# EasyEDA Pro project LEDclock_DCF77-RTC-BAT_2026-05-16.epro

# Schematic Schematic1
Board Name: Board1; Create Date: 2026-04-27; Page Name: P1; Project Name: LEDclock_DCF77-RTC-BAT; Schematic Name: Schematic1; Update Date: 2026-05-14; Company: EasyEDA.com; Page Size: A4; Version: V1.0
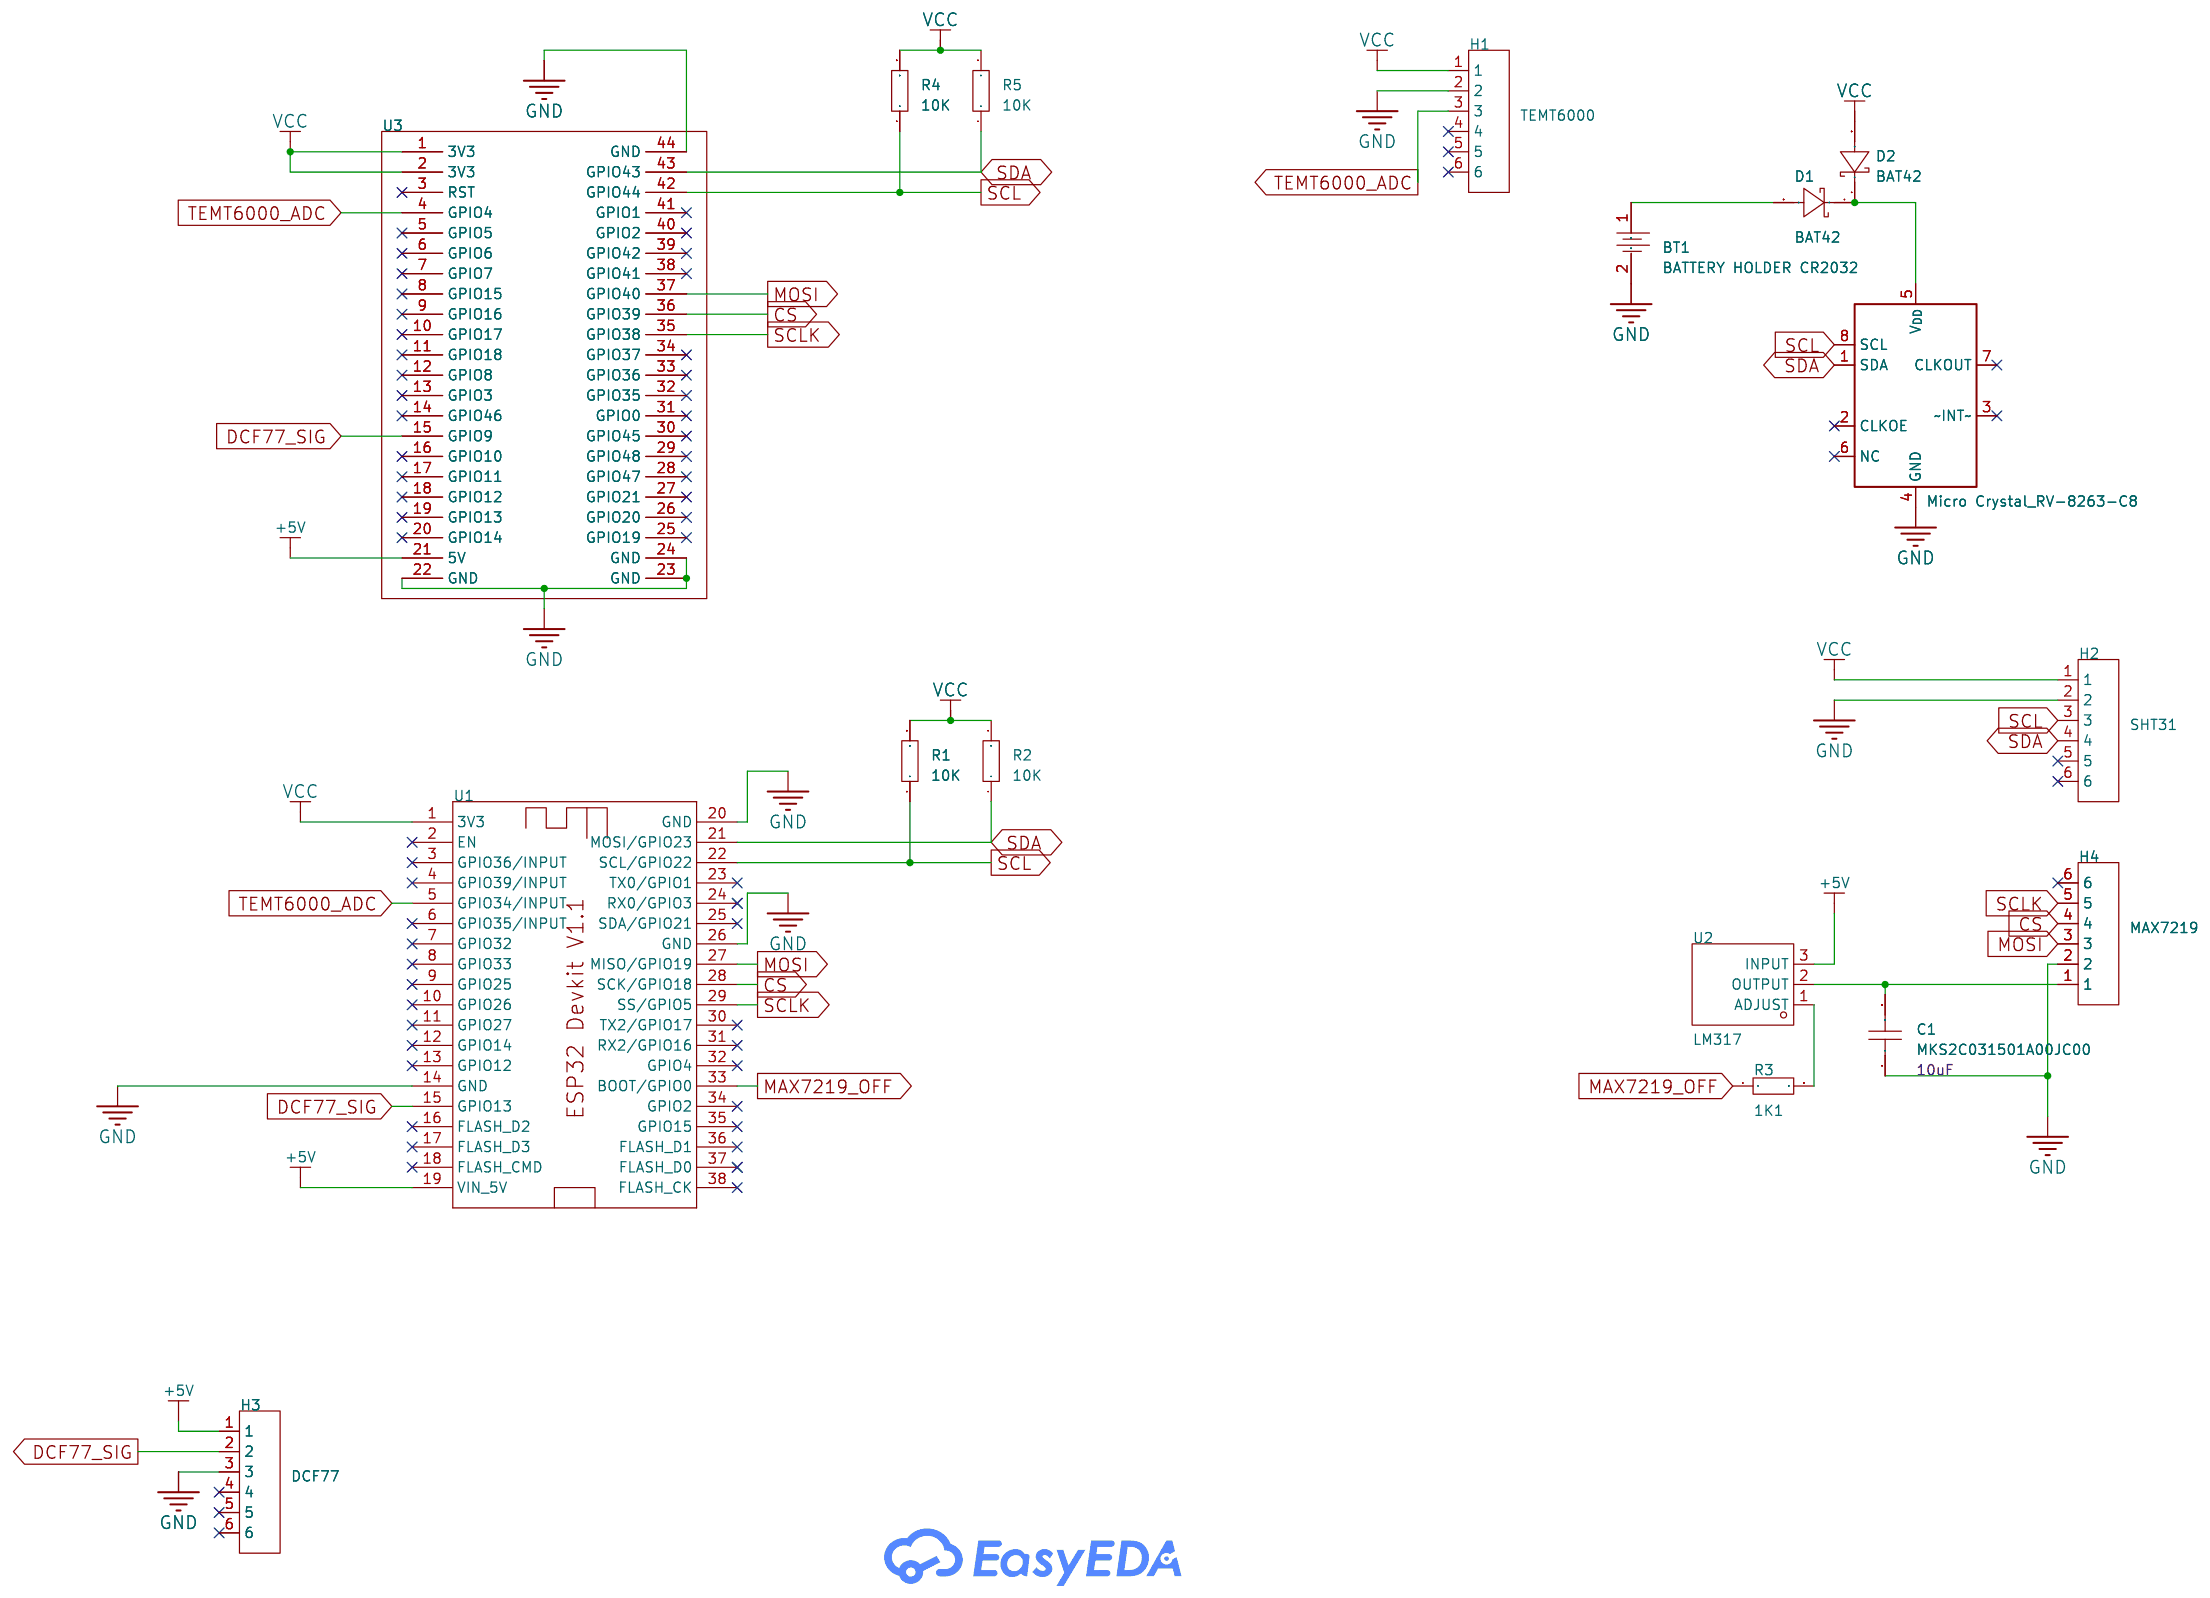
[diagram p0: schematic sheet]

## Parts
BT1  BATTERY HOLDER CR2032  [BAT-TH_FBA25014-S02B2004K]
C1  MKS2C031501A00JC00  [CAP-TH_L7.2-W2.5-P5.00-D0.5-1]
D1  BAT42  [DO-35_BD1.8-L4.1-P7.00-D0.5-RD]
D2  BAT42  [DO-35_BD1.8-L4.1-P7.00-D0.5-RD]
H1  TEMT6000  [CONN-TH_SSQ-106-03-G-S]
H2  SHT31  [CONN-TH_SSQ-106-03-G-S]
H3  DCF77  [CONN-TH_SSQ-106-03-G-S]
H4  MAX7219  [CONN-TH_SSQ-106-03-G-S]
IC2  RV-8263-C8  [Micro Crystal:RV-8263-C8]
R1  10K  [HDR-TH_2P-P5.08_12251103CNSNU000001]
R2  10K  [HDR-TH_2P-P5.08_12251103CNSNU000001]
R3  1K1  [HDR-TH_2P-P5.08_12251103CNSNU000001]
R4  10K  [HDR-TH_2P-P5.08_12251103CNSNU000001]
R5  10K  [HDR-TH_2P-P5.08_12251103CNSNU000001]
U1  -  [ESP32-DEVKIT-V1.0-38PIN-PCB1.1]
U2  LM317  [TO-220-3_L9.9-W4.5-P2.54-L-1]
U3  -  [ESP32-S3 ESP32-S3-DevKitC-1 N16R8]

## Library data of the parts
BT1 = FBA25014-S02B2004K: Connector Type:Battery Holder Battery Type:- Operating Temperature:-40℃~+85℃ Operating Temperature:-40℃~+85℃; Supplier Part: C2833828; Manufacturer: TXGA(特思嘉); Supplier Footprint: 插件; JLCPCB Part Class: Extended Part; Datasheet: https://item.szlcsc.com/datasheet/FBA25014-S02B2004K/2995292.html; Supplier: LCSC; Connector Type: Battery Holder; Operating Temperature: -40℃~+85℃
C1 = MKS2C031501A00JC00: Supplier Part: C7420631; Manufacturer: WIMA; Supplier Footprint: CAP-TH; JLCPCB Part Class: Extended Part; Datasheet: https://item.szlcsc.com/datasheet/MKS2C031501A00JC00/8399199.html; Supplier: LCSC; Capacitance: 10uF
D1 D2 = BAT42: Diode Configuration:Independent Voltage - Forward(Vf@If):650mV@50mA Voltage - DC Reverse(Vr):30V Current - Rectified:200mA Reverse Leakage Current (Ir):500nA@25V Operating Junction Temperature Range:-65℃~+125℃ Operating Junction Temperature Range:-65℃~+12; LCSC Part Name: 电压:30V 电流:200mA; Supplier Part: C2798198; Manufacturer: ST(意法半导体); Supplier Footprint: DO-35; JLCPCB Part Class: Extended Part; Datasheet: https://item.szlcsc.com/datasheet/BAT42/2937121.html; Supplier: LCSC; Diode Configuration: Independent; Voltage - Forward(Vf@If): 650mV@50mA; Voltage - DC Reverse(Vr): 30V; Current - Rectified: 200mA; Reverse Leakage Current (Ir): 500nA@25V; Operating Junction Temperature Range: -65℃~+125℃; Non-Repetitive Peak Forward Surge Current: 4A
H1-H4 = SSQ-106-03-G-S: Holes Structure:1x6P Pitch:2.54mm Row Spacing:- Circular Hole / Square Hole:Square Hole Mounting Type:Through Hole Number of Rows:1 Number of Positions:6P Current Rating:4.7A Voltage Rating (Max):655V Holes Direction:Top Insulation Height:8.51mm Contact M; LCSC Part Name: 1x6P 间距:2.54mm 直插; Supplier Part: C3323798; Manufacturer: SAMTEC; Supplier Footprint: 插件,P=2.54mm; JLCPCB Part Class: Extended Part; Datasheet: https://item.szlcsc.com/datasheet/SSQ-106-03-G-S/3888394.html; Supplier: LCSC; Holes Structure: 1x6P; Pitch: 2.54mm; Circular Hole / Square Hole: Square Hole; Mounting Type: Through Hole; Number of Rows: 1; Number of Positions: 6P; Current Rating: 4.7A; Voltage Rating (Max): 655V; Holes Direction: Top; Insulation Height: 8.51mm; Contact Material: Phosphor bronze; Contact Plating: Gold; Operating Temperature: -55℃~+125℃; PIN Length: 10mm
IC2 = Micro Crystal_RV-8263-C8: Attribute1: IC507; Datasheet: https://www.microcrystal.com/fileadmin/Media/Products/RTC/Datasheet/RV-8263-C8.pdf; manf: Micro Crystal; manf#: RV-8263-C8 32.768kHz-20PPM-TA-QA; mouser#: 428-204291-MC01; User doc link: https://www.microcrystal.com/fileadmin/Media/Products/RTC/Datasheet/RV-8263-C8.pdf
R1-R5 = Res_0603: Supplier Footprint: 0603
U1 = ESP32-DEVKIT-V1.1
U2 = LM317_C7463411: Output Type:Adjustable Voltage - Supply:40V Output Voltage:1.2V~37V Output Voltage:1.2V~37V Output Current:1.5A Power Supply Rejection Ratio (PSRR):75dB@(120Hz) standby current:46uA Features:Short Circuit Protection；Over Current Protection；Over Temperatur; LCSC Part Name: 1.2V~37V 1.5A 40V; Supplier Part: C7463411; Manufacturer: IDCHIP(英锐芯); Supplier Footprint: TO-220; JLCPCB Part Class: Extended Part; Datasheet: https://item.szlcsc.com/datasheet/LM317/8498176.html; Supplier: LCSC; Output Type: Adjustable; Voltage - Supply: 40V; Output Voltage: 1.2V~37V; Output Current: 1.5A; Power Supply Rejection Ratio (PSRR): 75dB@(120Hz); standby current: 46uA; Features: Short Circuit Protection；Over Current Protection；Over Temperature Protection; Operating Temperature: 0℃~+125℃; Output Configuration: Positive; Number of Outputs: 1
U3 = ESP32-S3 ESP32-S3-DevKitC-1 N16R8

## Nets
+5V: H3.1 U1.19(VIN_5V) U2.3(INPUT) U3.21(5V)
GND: BT1.2 C1.1 H1.2 H2.2 H3.3 H4.2 IC2.4(GND) U1.14(GND) U1.20(GND) U1.26(GND) U3.22(GND) U3.23(GND) U3.24(GND) U3.44(GND)
VCC: D2.2(A) H1.1 H2.1 R1.2 R2.2 R4.2 R5.2 U1.1(3V3) U3.1(3V3) U3.2(3V3)
CS: H4.4 U1.28(SCK/GPIO18) U3.36(GPIO39)
DCF77_SIG: H3.2 U1.15(GPIO13) U3.15(GPIO9)
MAX7219_OFF: R3.1 U1.33(BOOT/GPIO0)
MOSI: H4.3 U1.27(MISO/GPIO19) U3.37(GPIO40)
SCL: H2.3 IC2.8(SCL) R1.1 R4.1 U1.22(SCL/GPIO22) U3.42(GPIO44)
SCLK: H4.5 U1.29(SS/GPIO5) U3.35(GPIO38)
SDA: H2.4 IC2.1(SDA) R2.1 R5.1 U1.21(MOSI/GPIO23) U3.43(GPIO43)
TEMT6000_ADC: H1.3 U1.5(GPIO34/INPUT) U3.4(GPIO4)
$1N1771: BT1.1 D1.2(A)
$1N2344: C1.2 H4.1 U2.2(OUTPUT)
$1N3344: D1.1(K) D2.1(K) IC2.5(V_{DD})
$1N4735: R3.2 U2.1(ADJUST)

Not connected (* = marked no-connect by the designer): H1 4* 5* 6*; H2 5* 6*; H3 4* 5* 6*; H4 6*; IC2 2(CLKOE)* 3(~INT~)* 6(NC)* 7(CLKOUT)*; U1 2(EN)* 3(GPIO36/INPUT)* 4(GPIO39/INPUT)* 6(GPIO35/INPUT)* 7(GPIO32)* 8(GPIO33)* 9(GPIO25)* 10(GPIO26)* 11(GPIO27)* 12(GPIO14)* 13(GPIO12)* 16(FLASH_D2)* 17(FLASH_D3)* 18(FLASH_CMD)* 23(TX0/GPIO1)* 24(RX0/GPIO3)* 25(SDA/GPIO21)* 30(TX2/GPIO17)* 31(RX2/GPIO16)* 32(GPIO4)* 34(GPIO2)* 35(GPIO15)* 36(FLASH_D1)* 37(FLASH_D0)* 38(FLASH_CK)*; U3 3(RST)* 5(GPIO5)* 6(GPIO6)* 7(GPIO7)* 8(GPIO15)* 9(GPIO16)* 10(GPIO17)* 11(GPIO18)* 12(GPIO8)* 13(GPIO3)* 14(GPIO46)* 16(GPIO10)* 17(GPIO11)* 18(GPIO12)* 19(GPIO13)* 20(GPIO14)* 25(GPIO19)* 26(GPIO20)* 27(GPIO21)* 28(GPIO47)* 29(GPIO48)* 30(GPIO45)* 31(GPIO0)* 32(GPIO35)* 33(GPIO36)* 34(GPIO37)* 38(GPIO41)* 39(GPIO42)* 40(GPIO2)* 41(GPIO1)*

# Board PCB1 - Europlatine
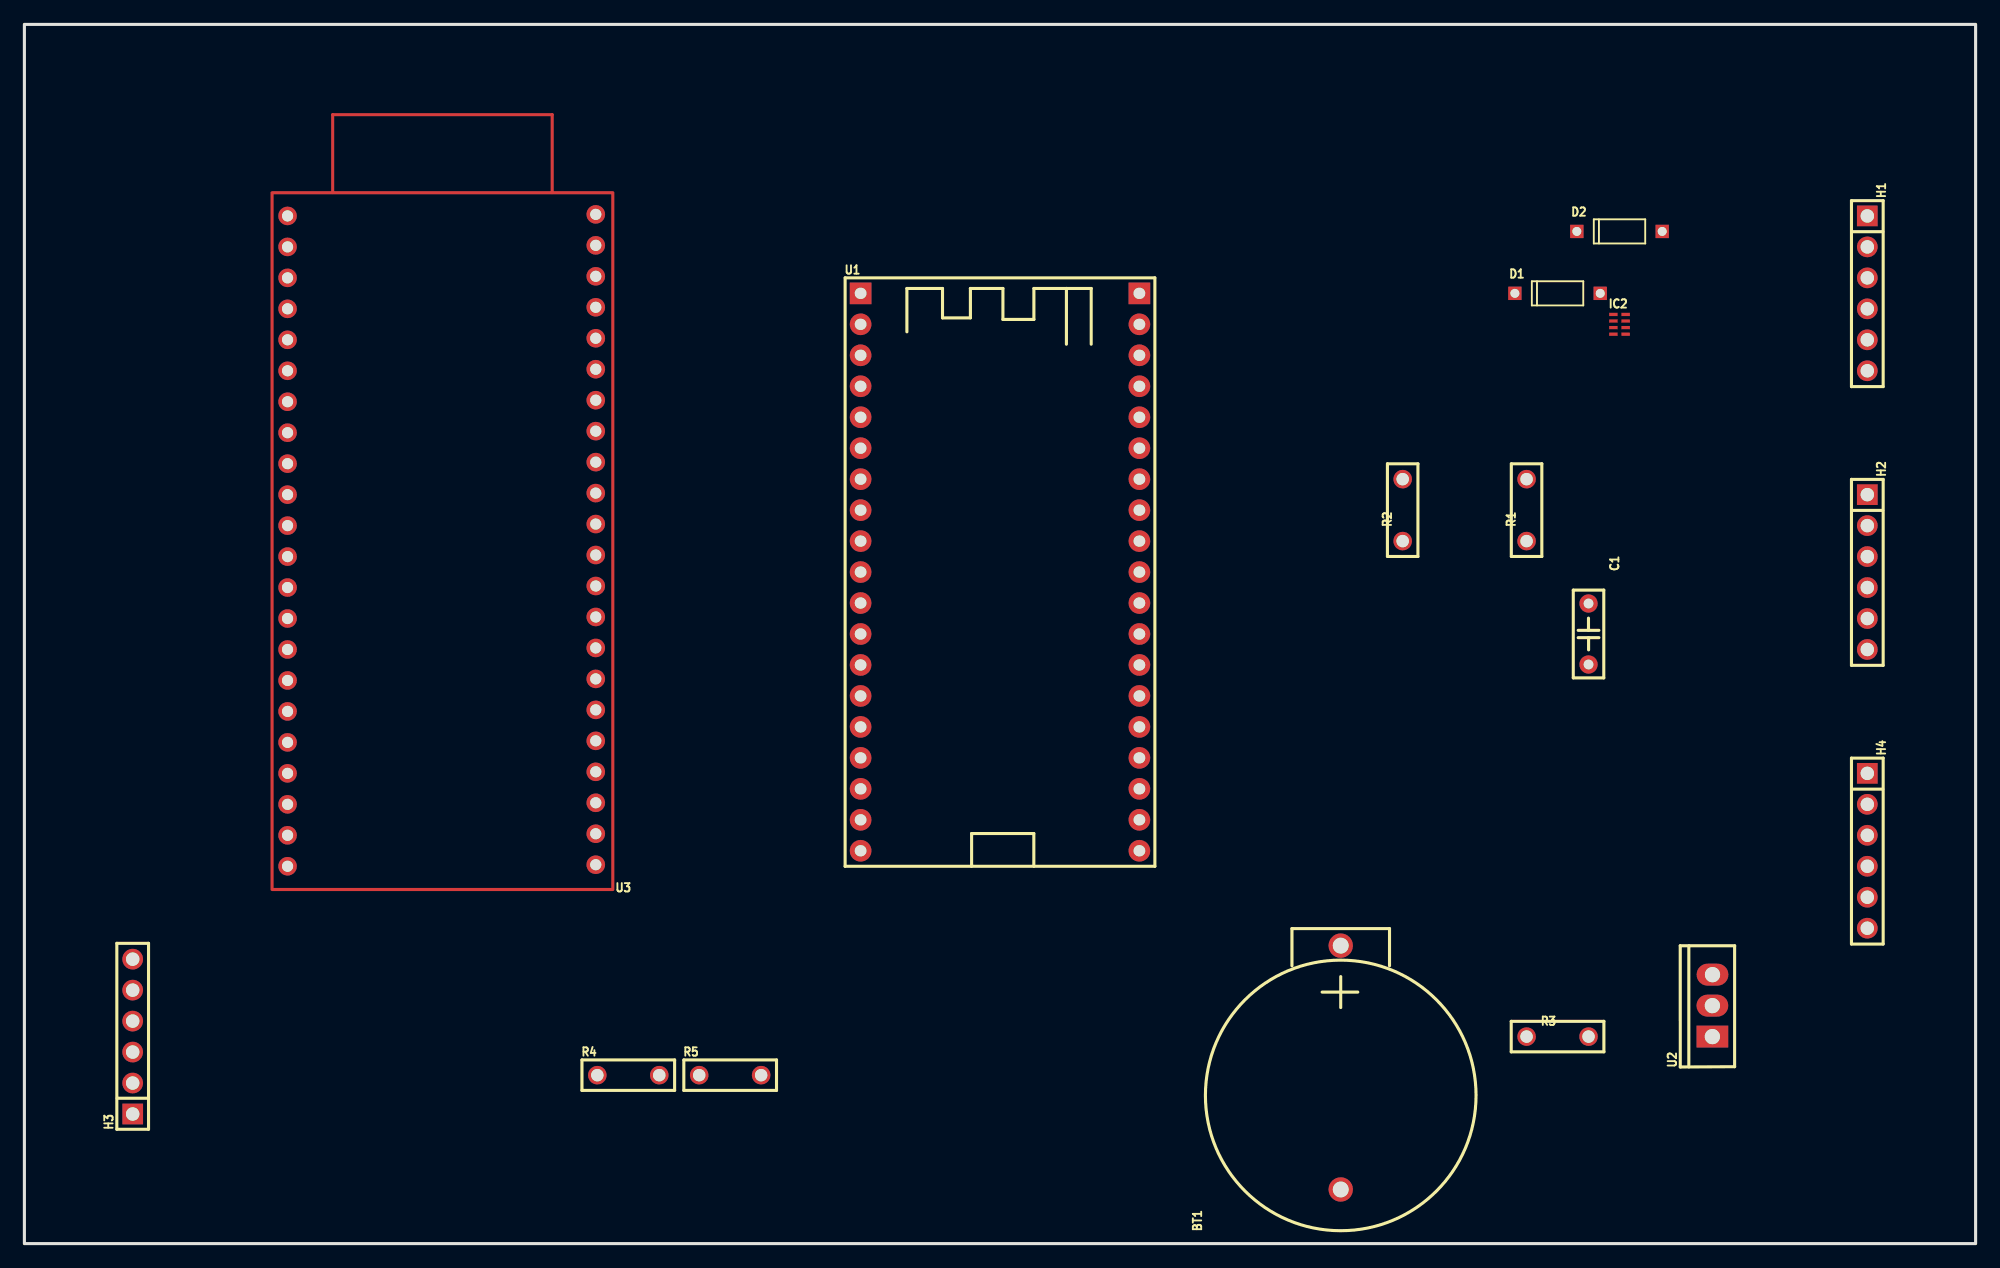
[diagram p1: board, top side]
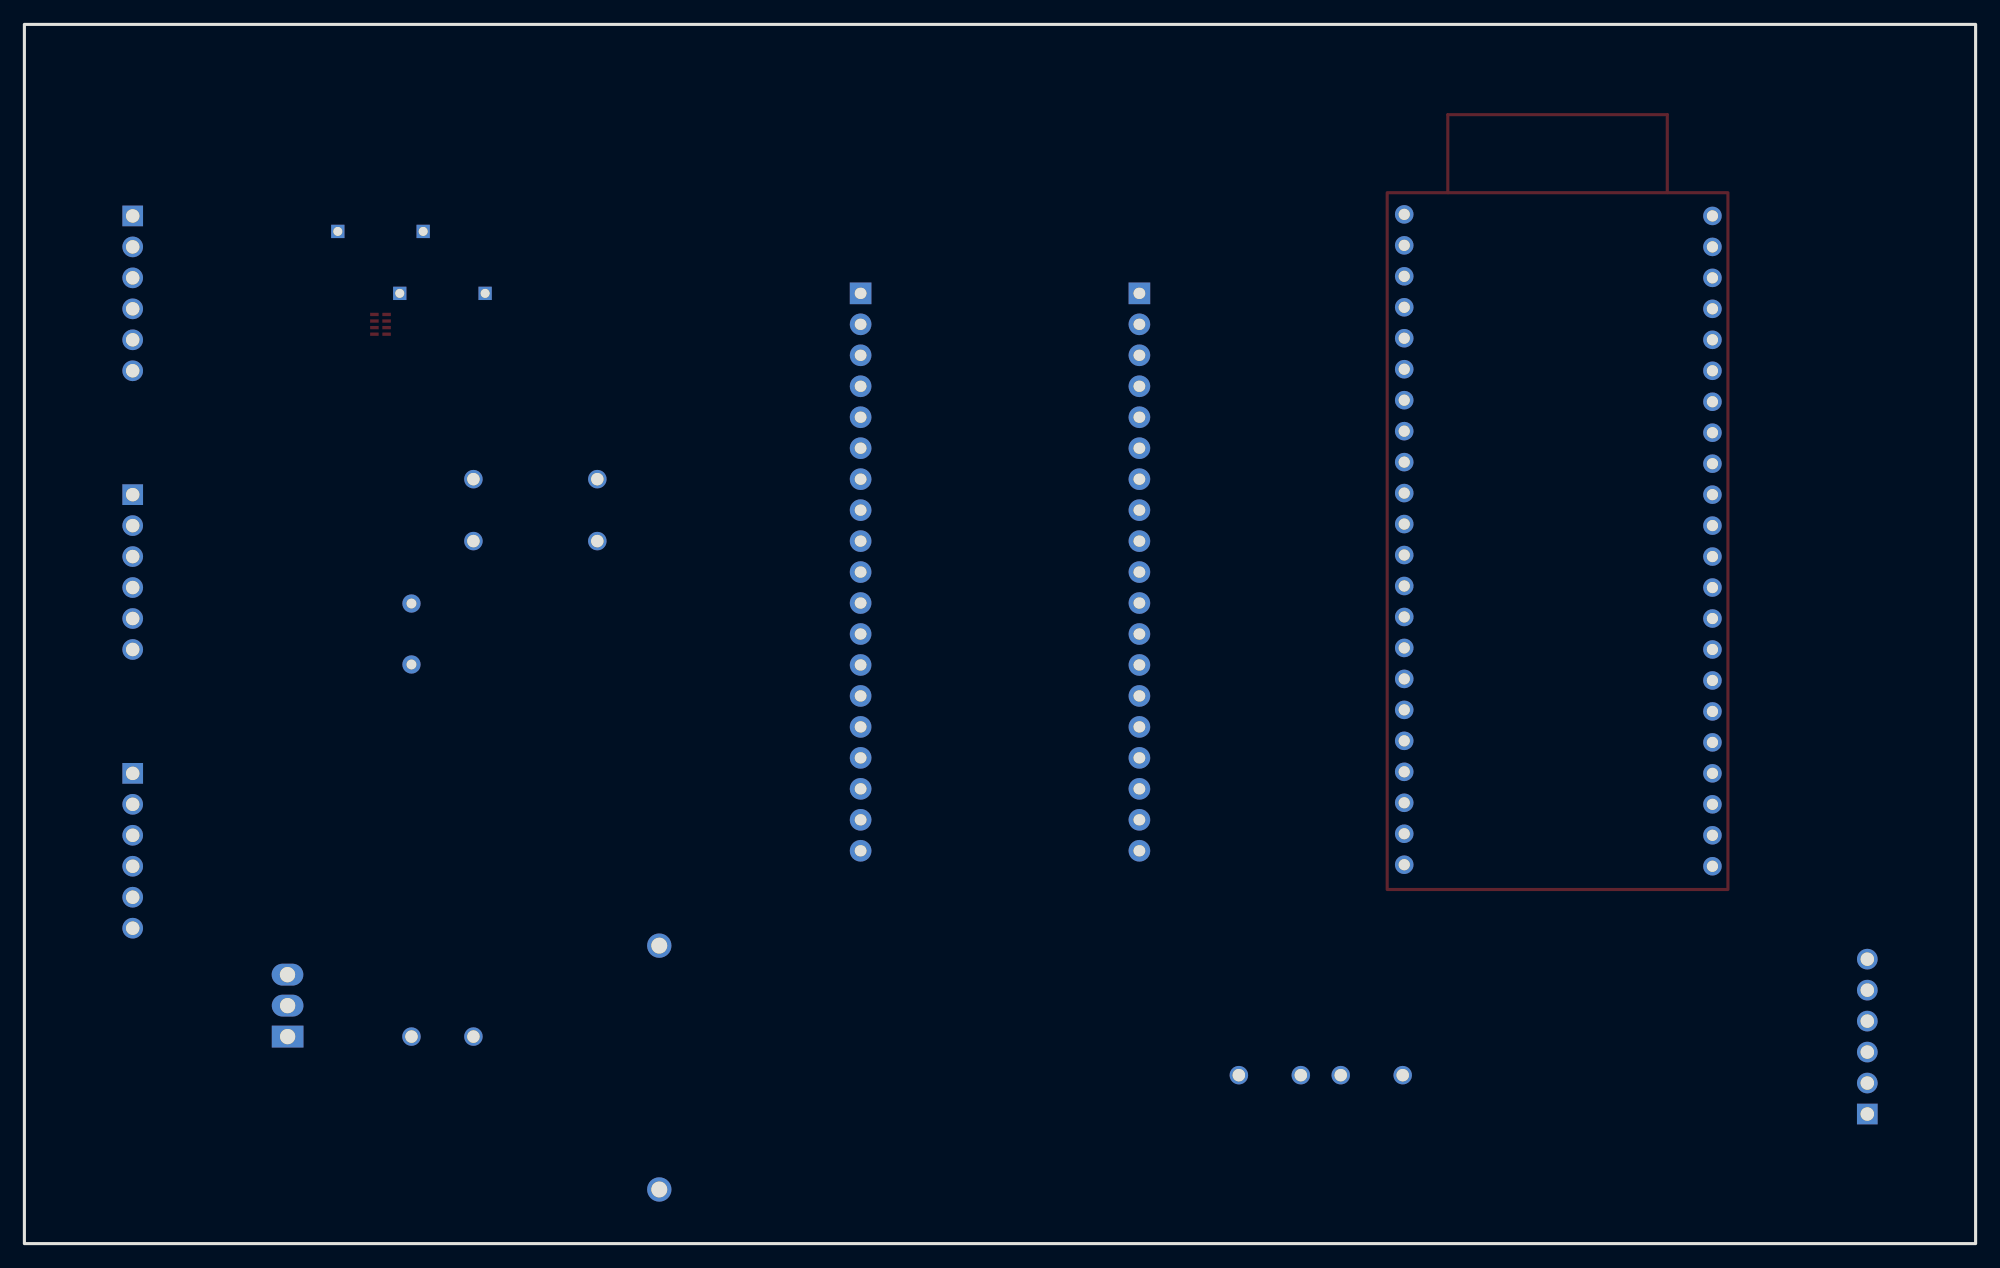
[diagram p2: board, bottom side, seen from below]

Outline 160 x 100 mm; copper layers: Top Layer, Bottom Layer. Coordinates in mm from the lower left corner of the outline.
Outline path: rectangle 0,100 160,0
Stack: Top Layer 0.035mm / Dielectric1 1.51mm FR4 er 4.5 / Bottom Layer 0.035mm

## Design rules (mm)
template: JLCPCB Capability(Two Layers Board)
spacing copperThickness1oz (default): track to track 0.102, other pairs 0.152 to 0.3
spacing copperThickness2oz: track to track 0.203, other pairs 0.152 to 0.3
track width copperThickness1oz (default): min 0.127, default 0.254, max 2.54
track width copperThickness2oz: min 0.203, default 0.254, max 2.54
differential pair differentialPair (default): width min 0.127, default 0.254, max 2.54; gap min 0.152, default 0.152
via viaSize (default): diameter min 0.5, default 0.61, max 10; hole min 0.3, default 0.305, max 6.3

## Placement (name value [footprint] x y rotation side)
BT1  BATTERY HOLDER CR2032  [BAT-TH_FBA25014-S02B2004K]  107.94 14.44 90 top
C1  MKS2C031501A00JC00  [CAP-TH_L7.2-W2.5-P5.00-D0.5-1]  128.26 50 270 top
D1  BAT42  [DO-35_BD1.8-L4.1-P7.00-D0.5-RD]  125.72 77.94 0 top
D2  BAT42  [DO-35_BD1.8-L4.1-P7.00-D0.5-RD]  130.8 83.02 0 top
H1  TEMT6000  [CONN-TH_SSQ-106-03-G-S]  151.12 77.94 270 top
H2  SHT31  [CONN-TH_SSQ-106-03-G-S]  151.12 55.08 270 top
H3  DCF77  [CONN-TH_SSQ-106-03-G-S]  8.88 16.98 90 top
H4  MAX7219  [CONN-TH_SSQ-106-03-G-S]  151.12 32.22 270 top
IC2  RV-8263-C8  [Micro Crystal:RV-8263-C8]  130.8 75.4 0 top
R1  10K  [HDR-TH_2P-P5.08_12251103CNSNU000001]  123.18 60.16 90 top
R2  10K  [HDR-TH_2P-P5.08_12251103CNSNU000001]  113.02 60.16 90 top
R3  1K1  [HDR-TH_2P-P5.08_12251103CNSNU000001]  125.72 16.98 0 top
R4  10K  [HDR-TH_2P-P5.08_12251103CNSNU000001]  49.52 13.82 0 top
R5  10K  [HDR-TH_2P-P5.08_12251103CNSNU000001]  57.87 13.82 0 top
U1  -  [ESP32-DEVKIT-V1.0-38PIN-PCB1.1]  80 55.08 0 top
U2  LM317  [TO-220-3_L9.9-W4.5-P2.54-L-1]  138.42 19.52 90 top
U3  -  [ESP32-S3 ESP32-S3-DevKitC-1 N16R8]  34.28 57.62 180 top

## Footprints (pads in the part's own frame, mm; a bottom-side part is the same pattern mirrored in y, then rotated)
BAT-TH_FBA25014-S02B2004K
  round 2 hole 1.3: 1(10,0) 2(-10,0)
CAP-TH_L7.2-W2.5-P5.00-D0.5-1
  round 1.5 hole 0.8: 1(-2.5,0) 2(2.5,0)
CONN-TH_SSQ-106-03-G-S
  rect 1.7x1.7 hole 1.1: 1(-6.35,0)
  round 1.7 hole 1.1: 2(-3.81,0) 3(-1.27,0) 4(1.27,0) 5(3.81,0) 6(6.35,0)
DO-35_BD1.8-L4.1-P7.00-D0.5-RD
  rect 1.095x1.095 hole 0.73: 1(-3.5,0) 2(3.5,0)
ESP32-DEVKIT-V1.0-38PIN-PCB1.1
  rect 1.778x1.778 hole 0.96x0.914: 1(-11.43,22.86) 20(11.43,22.86)
  round 1.778 hole 0.96x0.914: 2(-11.43,20.32) 3(-11.43,17.78) 4(-11.43,15.24) 5(-11.43,12.7) 6(-11.43,10.16) 7(-11.43,7.62) 8(-11.43,5.08) 9(-11.43,2.54) 10(-11.43,0) 11(-11.43,-2.54) 12(-11.43,-5.08) 13(-11.43,-7.62) 14(-11.43,-10.16) 15(-11.43,-12.7) 16(-11.43,-15.24) 17(-11.43,-17.78) 18(-11.43,-20.32) 19(-11.43,-22.86) 21(11.43,20.32) 22(11.43,17.78) 23(11.43,15.24) 24(11.43,12.7) 25(11.43,10.16) 26(11.43,7.62) 27(11.43,5.08) 28(11.43,2.54) 29(11.43,0) 30(11.43,-2.54) 31(11.43,-5.08) 32(11.43,-7.62) 33(11.43,-10.16) 34(11.43,-12.7) 35(11.43,-15.24) 36(11.43,-17.78) 37(11.43,-20.32) 38(11.43,-22.86)
ESP32-S3 ESP32-S3-DevKitC-1 N16R8
  round 1.524 hole 0.914: 1(12.7,-26.67) 2(12.7,-24.13) 3(12.7,-21.59) 4(12.7,-19.05) 5(12.7,-16.51) 6(12.7,-13.97) 7(12.7,-11.43) 8(12.7,-8.89) 9(12.7,-6.35) 10(12.7,-3.81) 11(12.7,-1.27) 12(12.7,1.27) 13(12.7,3.81) 14(12.7,6.35) 15(12.7,8.89) 16(12.7,11.43) 17(12.7,13.97) 18(12.7,16.51) 19(12.7,19.05) 20(12.7,21.59) 21(12.7,24.13) 22(12.7,26.67) 23(-12.573,26.543) 24(-12.573,24.003) 25(-12.573,21.463) 26(-12.573,18.923) 27(-12.573,16.383) 28(-12.573,13.843) 29(-12.573,11.303) 30(-12.573,8.763) 31(-12.573,6.223) 32(-12.573,3.683) 33(-12.573,1.143) 34(-12.573,-1.397) 35(-12.573,-3.937) 36(-12.573,-6.477) 37(-12.573,-9.017) 38(-12.573,-11.557) 39(-12.573,-14.097) 40(-12.573,-16.637) 41(-12.573,-19.177) 42(-12.573,-21.717) 43(-12.573,-24.257) 44(-12.573,-26.797)
HDR-TH_2P-P5.08_12251103CNSNU000001
  round 1.52 hole 1.02: 1(-2.54,0) 2(2.54,0)
Micro Crystal:RV-8263-C8
  rect 0.7x0.27 smd: 1(-0.5,0.81) 2(-0.5,0.27) 3(-0.5,-0.27) 4(-0.5,-0.81) 5(0.5,-0.81) 6(0.5,-0.27) 7(0.5,0.27) 8(0.5,0.81)
TO-220-3_L9.9-W4.5-P2.54-L-1
  rect 1.8x2.6 hole 1.25: 1(-2.54,0.005)
  oval 1.8x2.6 hole 1.25: 2(0,0.005) 3(2.54,-0.005)

## Nets
As in the schematic.

Pads without a net: H1 4 5 6; H2 5 6; H3 4 5 6; H4 6; IC2 2 3 6 7; U1 2 3 4 6 7 8 9 10 11 12 13 16 17 18 23 24 25 30 31 32 34 35 36 37 38; U3 3 5 6 7 8 9 10 11 12 13 14 16 17 18 19 20 25 26 27 28 29 30 31 32 33 34 38 39 40 41
